# EAGLE design HABduino3.0 (EAGLE 6.4)

## Sheet 1 of 2
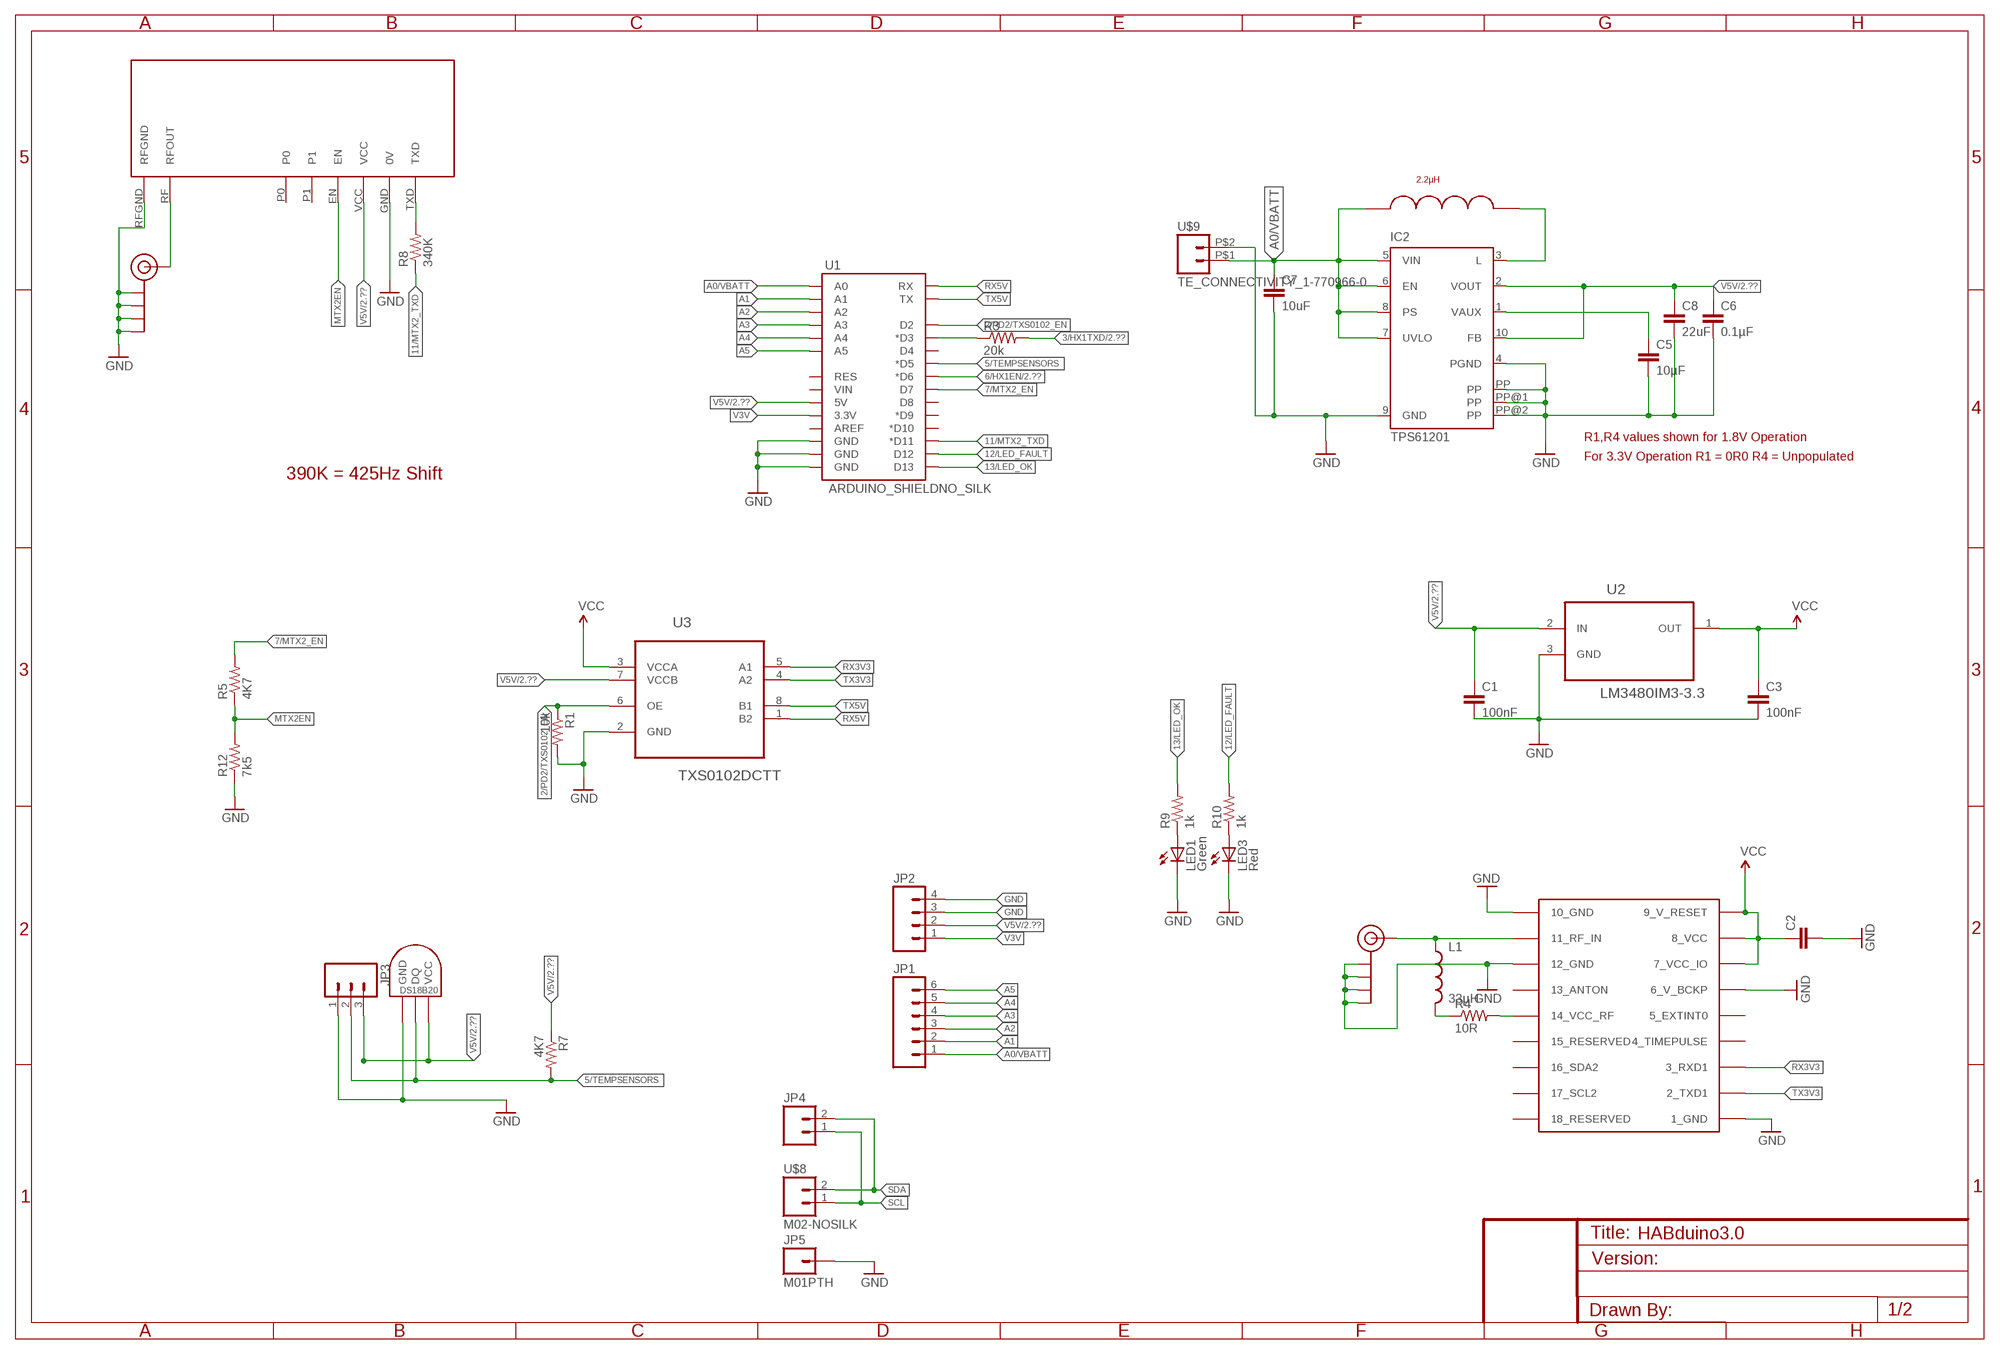
[diagram p0: schematic, sheet 1]

### Parts
C1  100nF  CAP0603-CAP  [0603-CAP]
C2  CAP0603-CAP  [0603-CAP]
C3  100nF  CAP0603-CAP  [0603-CAP]
C5  10µF  CAP0603-CAP  [0603-CAP]
C6  0.1µF  CAP0603-CAP  [0603-CAP]
C7  10uF  CAP1206  [1206]
C8  22uF  CAP1206  [1206]
IC2  TPS61201  [S-PDSO-N10]
J$1  SMA_EDGE  [SMA-EDGE]
J$2  SMA_EDGE  [SMA-EDGE]
JP1  M06SIP  [1X06]
JP2  M04PTH  [1X04]
JP3  M03PTH  [1X03]
JP4  M02PTH  [1X02]
JP5  M01PTH  [1X01]
L1  33µH  INDUCTOR0603  [0603]
LED1  Green  LED0603  [LED-0603]
LED3  Red  LED0603  [LED-0603]
LPS4018  2.2µH  COILCRAFT_LPS4018  [COILCRAFT_LPS4018]
R1  10k  RESISTOR0603-RES  [0603-RES]
R3  20k  RESISTOR0603-RES  [0603-RES]
R4  10R  RESISTOR0603-RES  [0603-RES]
R5  4K7  RESISTOR0603-RES  [0603-RES]
R7  4K7  RESISTOR0603-RES  [0603-RES]
R8  340K  RESISTOR0603-RES  [0603-RES]
R9  1k  RESISTOR0603-RES  [0603-RES]
R10  1k  RESISTOR0603-RES  [0603-RES]
R12  7k5  RESISTOR0603-RES  [0603-RES]
TEMP  DS1821  DS1820SOIC  [DS18B20_SOIC]
U1  ARDUINO_SHIELDNO_SILK  [DUEMILANOVE_VIAS]
U2  LM3480IM3-3.3  [SOT95P251X112-3N]
U3  TXS0102DCTT  [SOP65P400X130-8N]
U$1  UBLOX_MAX  [UBLOX_MAX]
U$4  RADIOMETRIX-MTX2  [RADIOMETRIX-MTX2]
U$8  M02-NOSILK  [M02-NOSILK]
U$9  TE_CONNECTIVITY_1-770966-0  [TE_CONNECTIVITY_1-770966-0]

### Nets
2/PD2/TXS0102_EN: R1.1 U1.D2 U3.6(OE)
3/HX1TXD: R3.2 ; also sheet 2
5/TEMPSENSORS: JP3.2 R7.2 TEMP.DQ U1.D5(*D5)
6/HX1EN: U1.D6(*D6) ; also sheet 2
7/MTX2_EN: R5.2 U1.D7
11/MTX2_TXD: R8.1 U1.D11(*D11)
12/LED_FAULT: R10.2 U1.D12
13/LED_OK: R9.2 U1.D13
A0/VBATT [vcc]: C7.1 IC2.5(VIN) IC2.6(EN) IC2.7(UVLO) IC2.8(PS) JP1.1 LPS4018.P$1 U1.A0 U$9.P$1
A1: JP1.2 U1.A1
A2: JP1.3 U1.A2
A3: JP1.4 U1.A3
A4: JP1.5 U1.A4
A5: JP1.6 U1.A5
GND [vcc]: C1.2 C2.2 C3.2 C5.2 C6.2 C7.2 C8.2 IC2.4(PGND) IC2.9(GND) IC2.PP IC2.PP@1(PP) IC2.PP@2(PP) J$1.GND@0(GND) J$1.GND@1(GND) J$1.GND@2(GND) J$1.GND@3(GND) J$2.GND@0(GND) J$2.GND@1(GND) J$2.GND@2(GND) J$2.GND@3(GND) JP2.3 JP2.4 JP3.1 JP5.1 LED1.C LED3.C R1.2 R12.1 TEMP.GND U1.GND@0(GND) U1.GND@1(GND) U1.GND@2(GND) U2.3(GND) U3.2(GND) U$1.1_GND U$1.6_V_BCKP U$1.10_GND U$1.12_GND U$4.GND(0V) U$4.RFGND U$9.P$2 ; also sheet 2
MTX2EN: R5.1 R12.2 U$4.EN
N$2: R3.1 U1.D3(*D3)
N$3: J$1.SIG(SIGNAL) U$4.RF(RFOUT)
N$4: J$2.SIG(SIGNAL) L1.1 U$1.11_RF_IN
N$5: IC2.3(L) LPS4018.P$2
N$7: R8.2 U$4.TXD
N$11: C5.1 IC2.1(VAUX)
N$12: LED1.A R9.1
N$13: LED3.A R10.1
N$14: L1.2 R4.1
N$15: R4.2 U$1.14_VCC_RF
RX3V3: U3.5(A1) U$1.3_RXD1
RX5V: U1.RX U3.1(B2)
SCL: JP4.1 U$8.1
SDA: JP4.2 U$8.2
TX3V3: U3.4(A2) U$1.2_TXD1
TX5V: U1.TX U3.8(B1)
V3V: JP2.1 U1.3.3V
V5V: C1.1 C6.1 C8.1 IC2.2(VOUT) IC2.10(FB) JP2.2 JP3.3 R7.1 TEMP.VCC U1.5V U2.2(IN) U3.7(VCCB) U$4.VCC ; also sheet 2
VCC: C2.1 C3.1 U2.1(OUT) U3.3(VCCA) U$1.7_VCC_IO U$1.8_VCC U$1.9_V_RESET
Unconnected: U1.AREF U1.D4 U1.D8 U1.D9(*D9) U1.D10(*D10) U1.RES U1.VIN U$1.4_TIMEPULSE U$1.5_EXTINT0 U$1.13_ANTON U$1.15_RESERVED U$1.16_SDA2 U$1.17_SCL2 U$1.18_RESERVED U$4.P0 U$4.P1

### Notes on the sheet
- R1,R4 values shown for 1.8V Operation
- For 3.3V Operation R1 = 0R0 R4 = Unpopulated
- 390K = 425Hz Shift

## Sheet 2 of 2
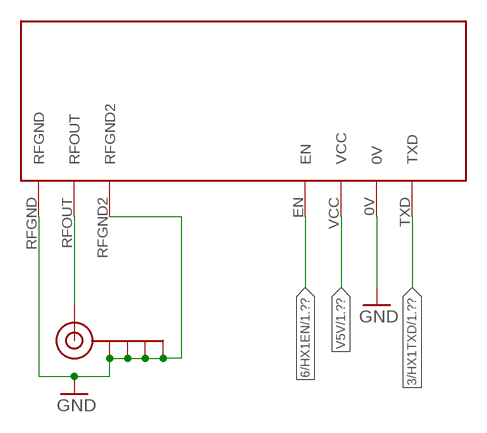
[diagram p1: schematic, sheet 2]

### Parts
J$3  SMA_EDGE  [SMA-EDGE]
U$7  RADIOMETRIX-HX1  [RADIOMETRIX-HX1]

### Nets
3/HX1TXD: U$7.TXD ; also sheet 1
6/HX1EN: U$7.EN ; also sheet 1
GND [vcc]: J$3.GND@0(GND) J$3.GND@1(GND) J$3.GND@2(GND) J$3.GND@3(GND) U$7.0V U$7.RFGND U$7.RFGND2 ; also sheet 1
N$1: J$3.SIG(SIGNAL) U$7.RFOUT
V5V: U$7.VCC ; also sheet 1

## Library data of the parts
C1-C3 C5-C8 = SparkFun:CAP: Capacitor Standard 0603 ceramic capacitor, and 0.1" leaded capacitor.
IC2 = texas:TPS6120*: LOW INPUT VOLTAGE SYNCHRONOUS BOOST CONVERTER WITH 1.3-A SWITCHES Source: http://focus.ti.com/lit/ds/symlink/tps61200.pdf; MPN: TPS61201DRCT; OC_FARNELL: unknown; OC_NEWARK: 37M0068
J$1-J$3 = SparkFun:SMA_EDGE: SMA Antenna Connector End launch SMA connector. The paste layer has been removed so that the connector can be hand soldered onto the board after reflow.
JP1 = SparkFun:M06: Header 6 Standard 6-pin 0.1" header. Use with straight break away headers (SKU : PRT-00116), right angle break away headers (PRT-00553), swiss pins (PRT-00743), machine pins (PRT-00117), and female headers (PRT-00115). Molex polarized connector foot print use with SKU : PRT-08094 with associated crimp pins and housings. NOTES ON THE VARIANTS LOCK and LOCK_LONGPADS... This footprint was designed to help hold the alignment of a through-hole component (i.e. 6-pin header) while soldering it into place. You may notice that each hole has been shifted either up or down by 0.005 of an inch from it's more standard position (which is a perfectly straight line). This slight alteration caused the pins (the squares in the middle) to touch the edges of the holes. Because they are alternating, it causes a "brace" to hold the component in place. 0.005 has proven to be the perfect amount of "off-center" position when using our standard breakaway headers. Although looks a little odd when you look at the bare footprint, once you have a header in there, the alteration is very hard to notice. Also, if you push a header all the way into place, it is covered up entirely on the bottom side. This idea of altering the position of holes to aid alignment will be further integrated into the Sparkfun Library for other footprints. It can help hold any component with 3 or more connection pins.
JP2 = SparkFun:M04: Header 4 Standard 4-pin 0.1" header. Use with straight break away headers (SKU : PRT-00116), right angle break away headers (PRT-00553), swiss pins (PRT-00743), machine pins (PRT-00117), and female headers (PRT-00115). Molex polarized connector foot print use with SKU : PRT-08231 with associated crimp pins and housings. 1MM SMD Version SKU: PRT-10208
JP3 = SparkFun:M03: Header 3 Standard 3-pin 0.1" header. Use with straight break away headers (SKU : PRT-00116), right angle break away headers (PRT-00553), swiss pins (PRT-00743), machine pins (PRT-00117), and female headers (PRT-00115). Molex polarized connector foot print use with SKU : PRT-08232 with associated crimp pins and housings.
JP4 = SparkFun:M02: Header 2 Standard 2-pin 0.1" header. Use with straight break away headers (SKU : PRT-00116), right angle break away headers (PRT-00553), swiss pins (PRT-00743), machine pins (PRT-00117), and female headers (PRT-00115). Molex polarized connector foot print use with SKU : PRT-08233 with associated crimp pins and housings.
JP5 = SparkFun:M01: Header 1 Standard 1-pin 0.1" header. Use with straight break away headers (SKU : PRT-00116), right angle break away headers (PRT-00553), swiss pins (PRT-00743), machine pins (PRT-00117), and female headers (PRT-00115).
L1 = SparkFun:INDUCTOR: Inductors Basic Inductor/Choke - 0603 and 1206. Footprints are not proven and vary greatly between part numbers.
LED1 LED3 = SparkFun:LED: LEDs Standard schematic elements and footprints for 5mm, 3mm, 1206, and 0603 sized LEDs. 5mm - Spark Fun Electronics SKU : COM-00529 (and others)
LPS4018 = StevesCoilCraft:COILCRAFT_LPS4018: CoilCraft LPS4018 series inductor
R1 R3-R5 R7-R10 R12 = SparkFun:RESISTOR: Resistor Basic schematic elements and footprints for 0603, 1206, and PTH resistors.
TEMP = ava:DS1820: DS18B20 Programmable Resolution 1-Wire Digital Thermometer Description The DS18B20 digital thermometer provides 9-bit to 12-bit Celsius temperature measurements and has an alarm function with nonvolatile user-programmable upper and lower trigger points. The DS18B20 communicates over a 1-Wire® bus that by definition requires only one data line (and ground) for communication with a central microprocessor. It has an operating temperature range of -55°C to +125°C and is accurate to ±0.5°C over the range of -10°C to +85°C. In addition, the DS18B20 can derive power directly from the data line ("parasite power"), eliminating the need for an external power supply. Each DS18B20 has a unique 64-bit serial code, which allows multiple DS18B20s to function on the same 1-Wire bus. Thus, it is simple to use one microprocessor to control many DS18B20s distributed over a large area. Applications that can benefit from this feature include HVAC environmental controls, temperature monitoring systems inside buildings, equipment, or machinery, and process monitoring and control systems.
U1 = SparkFun:ARDUINO_SHIELD
U2 = ava:LM3480IM3-3.3: Low-Dropout Linear Voltage; MPN: LM3480IM3-3.3; OC_FARNELL: 1469102; OC_NEWARK: 41K4825; PACKAGE: SOT-3; SUPPLIER: National Semiconductor
U3 = ava:TXS0102DCTT: BIDIRECTIONAL VOLTAGE-LEVEL TRANSLATOR; MPN: TXS0102DCTT; OC_FARNELL: 1567203; OC_NEWARK: 48M1002; PACKAGE: SSOP-8; SUPPLIER: Texas Instruments
U$1 = ava:UBLOX_MAX: UBLOX MAX
U$4 = ava:RADIOMETRIX-MTX2
U$7 = ava:RADIOMETRIX-HX1
U$8 = ava:M02-NOSILK
U$9 = ava:TE_CONNECTIVITY_1-770966-0; FARNELL: 1098556

## Net classes
0 default: width 0.203 mm
1 vcc: width 0.254 mm
2 gnd: width 0.305 mm, drill 0.508 mm, clearance 0.152 mm

## Board
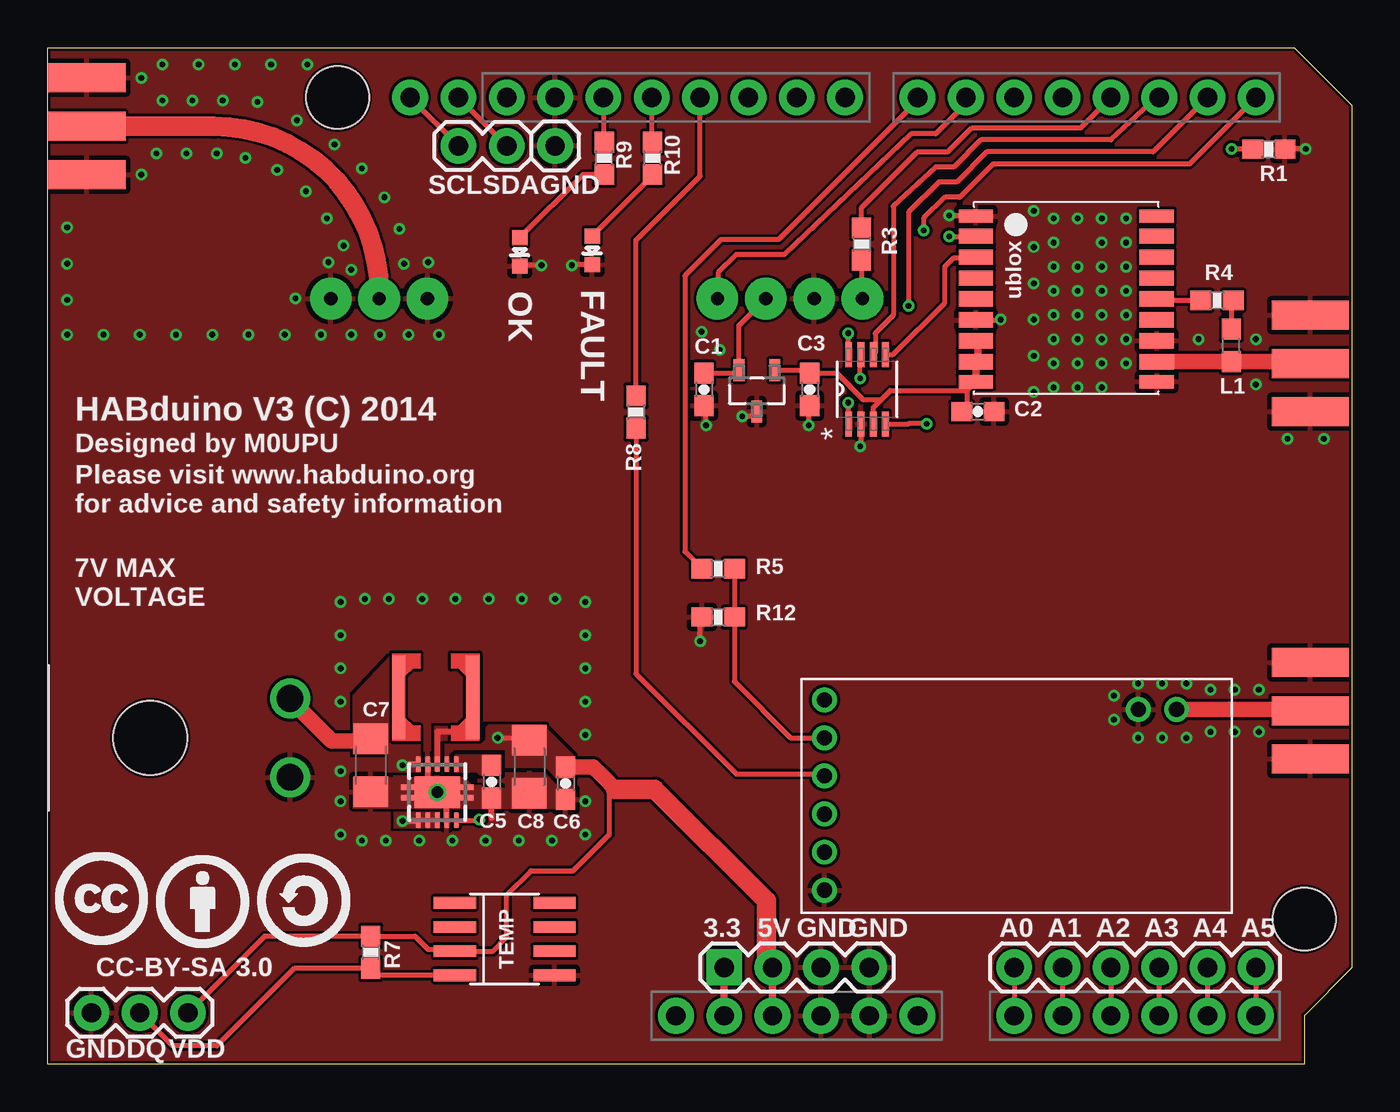
[diagram p2: board, top side]
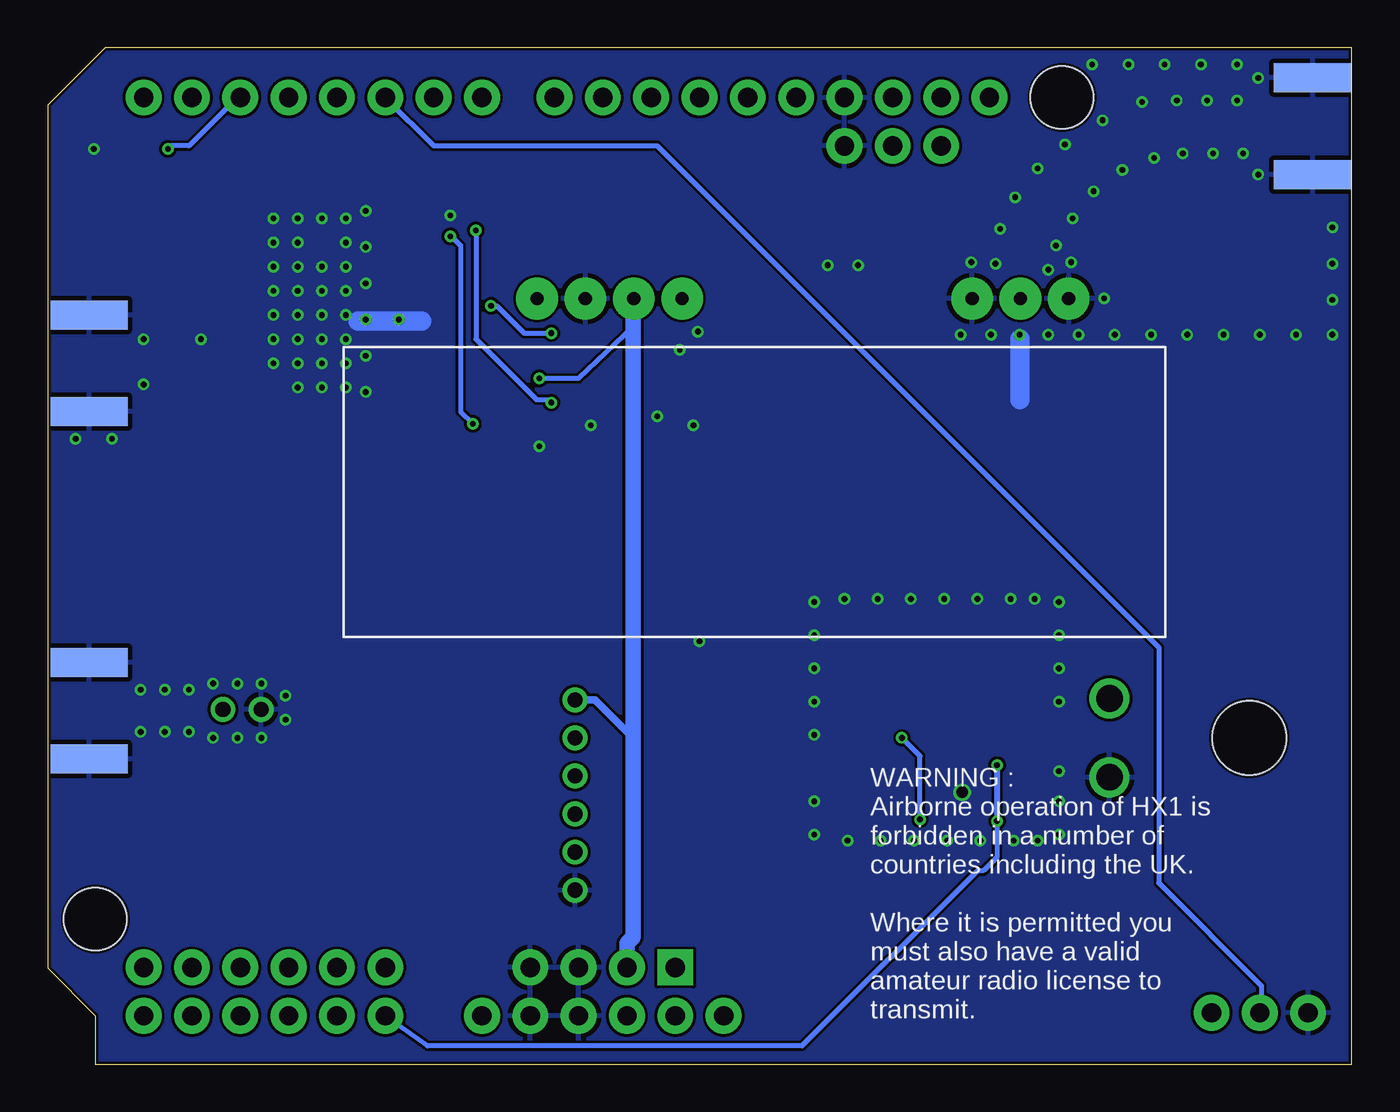
[diagram p3: board, bottom side, seen from below]

Size 68.55 x 53.43 mm. Coordinates in mm from the lower left corner, seen from the top.
Outline: 0,53.43 65.52,53.43 68.55,50.4 68.55,5.05 68.53,5.05 66.04,2.54 66.04,0 0,0 0,53.43
Copper layers (1*16): Top 0.035mm / dielectric 1.5mm / Bottom 0.035mm
Design rules "Hackvana": minimum track width 6mil, minimum drill 0.3mm, track to track 6mil, track to pad 6mil, pad to pad 6mil, via to via 6mil, smd to smd 0mil, copper to edge 6mil, drill to drill 6mil, minimum pad ring 10mil, minimum via ring 6mil, stop-mask expansion 2mil, vias tented up to drill 100mil, thermal gap 10mil
Holes 3.3 mm at 66.04,7.62 15.24,50.8

### Footprints (pad centres in the part's own frame; a part is rotated, then mirrored left to right if it is on the bottom)
0603-CAP = smd 1.1 x 1: 1 -0.85,0; 2 0.85,0
1206 = smd 1.6 x 1.8: 1 -1.4,0; 2 1.4,0
S-PDSO-N10 = smd 0.28 x 0.85: 1 -1,-1.475; 2 -0.5,-1.475; 3 0,-1.475; 4 0.5,-1.475; 5 1,-1.475; 6 1,1.475; 7 0.5,1.475; 8 0,1.475; 9 -0.5,1.475; 10 -1,1.475 | smd 2.4 x 1.65: PP 0,0 | smd 3.8 x 0.28: PP@1 0,0.275; PP@2 0,-0.275
SMA-EDGE = smd 1.524 x 4.064: GND@0 -2.54,0; GND@1 2.54,0; SIG 0,0 | smd 1.524 x 4.064 bottom: GND@2 -2.54,0; GND@3 2.54,0
1X06 = drill 1.016 pad 1.88: 1 0,0; 2 2.54,0; 3 5.08,0; 4 7.62,0; 5 10.16,0; 6 12.7,0
1X04 = drill 1.016 pad 1.88 square: 1 0,0 | drill 1.016 pad 1.88: 2 2.54,0; 3 5.08,0; 4 7.62,0
1X03 = drill 1.016 pad 1.88: 1 0,0; 2 2.54,0; 3 5.08,0
1X02 = drill 1.016 pad 1.88: 1 0,0; 2 2.54,0
1X01 = drill 1.016 pad 1.88: 1 0,0
0603 = smd 1.1 x 1: 1 -0.85,0; 2 0.85,0
LED-0603 = smd 0.8 x 0.8: A 0,-0.75; C 0,0.75
COILCRAFT_LPS4018 = smd 0.7 x 4.4: P$1 -1.95,0; P$2 1.95,0
0603-RES = smd 1.1 x 1: 1 -0.85,0; 2 0.85,0
DS18B20_SOIC = smd 0.61 x 2.21: DQ 1.905,-2.616; GND 1.905,2.616; NC -1.905,-2.616; NC2 -0.635,-2.616; NC3 -1.905,2.616; NC4 -0.635,2.616; NC5 0.635,2.616; VCC 0.635,-2.616
DUEMILANOVE_VIAS = drill 1.016 pad 1.88: 3.3V 50.8,13.97; 5V 50.8,16.51; A0 50.8,29.21; A1 50.8,31.75; A2 50.8,34.29; A3 50.8,36.83; A4 50.8,39.37; A5 50.8,41.91; AREF 2.54,2.54; D2 2.54,36.83; D3 2.54,34.29; D4 2.54,31.75; D5 2.54,29.21; D6 2.54,26.67; D7 2.54,24.13; D8 2.54,20.32; D9 2.54,17.78; D10 2.54,15.24; D11 2.54,12.7; D12 2.54,10.16; D13 2.54,7.62; GND@0 50.8,19.05; GND@1 50.8,21.59; GND@2 2.54,5.08; RES 50.8,11.43; RX 2.54,41.91; TX 2.54,39.37; VIN 50.8,24.13
SOT95P251X112-3N = smd 0.559 x 1.143: 1 -0.94,-1.092; 2 0.94,-1.092; 3 0,1.092
SOP65P400X130-8N = smd 1.321 x 0.356: 1 -1.829,0.965; 2 -1.829,0.33; 3 -1.829,-0.33; 4 -1.829,-0.965; 5 1.829,-0.965; 6 1.829,-0.33; 7 1.829,0.33; 8 1.829,0.965
UBLOX_MAX = smd 1.8 x 0.7: 1_GND 4.95,-4.4; 9_V_RESET 4.95,4.3; 10_GND -4.55,4.3; 18_RESERVED -4.55,-4.4 | smd 1.8 x 0.8: 2_TXD1 4.95,-3.35; 3_RXD1 4.95,-2.25; 4_TIMEPULSE 4.95,-1.15; 5_EXTINT0 4.95,-0.05; 6_V_BCKP 4.95,1.05; 7_VCC_IO 4.95,2.15; 8_VCC 4.95,3.25; 11_RF_IN -4.55,3.25; 12_GND -4.55,2.15; 13_ANTON -4.55,1.05; 14_VCC_RF -4.55,-0.05; 15_RESERVED -4.55,-1.15; 16_SDA2 -4.55,-2.25; 17_SCL2 -4.55,-3.35
RADIOMETRIX-MTX2 = drill 0.8: EN 9.97,-3.25; GND 9.97,4.75; P0 9.97,2.75; P1 9.97,0.75; RF -8.53,-4.75; RFGND -6.53,-4.75; TXD 9.97,-1.25; VCC 9.97,-5.25
RADIOMETRIX-HX1 = drill 0.7 pad 2.184: 0V 8.89,-10.16; EN 3.81,-10.16; RFGND -11.43,-10.16; RFGND2 -16.51,-10.16; RFOUT -13.97,-10.16; TXD 11.43,-10.16; VCC 6.35,-10.16
M02-NOSILK = drill 1.016 pad 1.88: 1 0,0; 2 2.54,0
TE_CONNECTIVITY_1-770966-0 = drill 1.4: P$1 -2.07,7.34; P$2 2.07,7.34 | hole 3.9: 0,0

### Placement (x,y rotation side)
C1  34.5,35.46 270 top
C2  48.9,34.29 0 top
C3  40.05,35.46 270 top
C5  23.34,14.84 270 top
C6  27.23,14.76 270 top
C7  16.99,15.72 270 top
C8  25.32,15.64 270 top
IC2  20.48,14.29 180 top
J$1  66.36,18.57 90 top
J$2  66.36,36.83 90 top
J$3  2.06,49.29 90 top
JP1  50.8,5.08 0 top
JP2  35.56,5.08 0 top
JP3  2.3,2.7 0 top
JP4  21.59,48.26 0 top
JP5  26.67,48.26 0 top
L1  62.2,37.77 90 top
LED1  24.81,42.69 180 top
LED3  28.62,42.77 180 top
LPS4018  20.4,19.29 0 top
R1  64.18,48.09 0 top
R3  42.78,43.1 270 top
R4  61.46,40.14 180 top
R5  35.24,26.04 180 top
R7  16.99,5.87 270 top
R8  30.92,34.27 270 top
R9  29.26,47.61 90 top
R10  31.8,47.61 90 top
R12  35.24,23.5 0 top
TEMP  24.02,6.57 270 top
U1  21.59,53.34 270 top
U2  37.27,35.39 180 top
U3  43.07,35.46 90 top
U$1  53.74,40.16 180 top
U$3  [CC]  0.4,6.27 0 top
U$4  50.8,13.89 180 top
U$5  [CC-BY-21]  5.71,6.11 0 top
U$6  [CC-SA-21]  11.03,6.18 0 top
U$7  31.39,30.07 180 bottom
U$8  19.05,50.8 0 top
U$9  5.4,17.14 270 top

### Tracks (layer width: path | path; a pad name or v marks a point on that pad's centre or on a via)
2/PD2/TXS0102_EN  (via drill 0.3)
  Top 0.254: U1.D2 58.26,50.8 55.88,48.58 49.05,48.58 47.62,47.15 46.67,47.15 44.45,45.09 44.45,39.37 43.5,38.42 43.5,37.39 U3.6 | v62.23,48.1 63.32,48.1 R1.1
  Bottom 0.254: U1.D2 58.58,50.8 61.12,48.26 62.07,48.26 v62.23,48.1
3/HX1TXD
  Top 0.254: R3.2 42.78,40.27 U$7.TXD
5/TEMPSENSORS
  Top 0.254: TEMP.DQ 17.34,4.67 R7.2 12.96,5.02 8.89,0.95 6.59,0.95 JP3.2
  Bottom 0.254: U1.D5 48.26,48.26 36.51,48.26 10.16,21.91 10.16,9.53 4.76,4.13 4.76,2.78 JP3.2
6/HX1EN
  Top 0.254: U$7.EN 35.24,40.27 35.24,41.59 36.2,42.55 38.73,42.55 45.4,48.9 46.67,48.9 48.26,50.48 U1.D6
7/MTX2_EN
  Top 0.254: R5.2 33.5,26.93 33.5,41.43 35.4,43.34 38.42,43.34 45.64,50.56 45.72,50.64 U1.D7
11/MTX2_TXD
  Top 0.254: R8.1 30.92,43.31 34.29,46.67 U1.D11
12/LED_FAULT
  Top 0.254: U1.D12 31.75,48.51 R10.2
13/LED_OK
  Top 0.254: U1.D13 29.21,48.51 R9.2
A0/VBATT  (via drill 0.3)
  Top 0.254: 18.57,12.86 18.62,12.81 IC2.8 18.69,12.81 v18.65,12.78 | JP1.1 U1.A0
  Top 0.305: IC2.5 18.7,15.76 v18.65,15.72 | v18.65,12.78 19.45,12.78 IC2.6
  Top 0.813: C7.1 16.86,16.99 14.92,16.99 12.74,19.17 U$9.P$1
  Bottom 0.254: v18.65,12.78 18.65,10.87 19.37,10.16 19.68,10.16 28.89,0.95 48.58,0.95 U1.A0
  Bottom 0.305: v18.65,15.72 v18.65,12.78
  pour Top (no thermals): 19.61,15.32 17.86,15.32 17.86,16.27 16.03,16.27 16.03,19.37 18.1,21.59 18.81,21.59 18.81,17.62 19.61,17.07
  pour Top (no thermals): 20.64,13.26 20.64,12.38 18.18,12.38 18.18,13.26
A1
  Top 0.254: JP1.2 U1.A1
A2
  Top 0.254: JP1.3 U1.A2
A3
  Top 0.254: U1.A3 JP1.4
A4
  Top 0.254: JP1.5 U1.A4
A5
  Top 0.254: JP1.6 U1.A5
GND  (via drill 0.3, 0.6)
  Top 0.254: v47.39,44.61 48.74,44.61 U$1.1_GND | U3.2 42.74,32.5 v42.7,32.46 | v34.61,33.58 34.61,34.5 C1.2 | v36.51,34.05 37.03,34.05 U2.3 | v40.01,33.58 40.01,34.57 C3.2 | v66.12,48.1 65.05,48.1 R1.2 | U$1.6_V_BCKP 50.07,39.11 v50.09,39.13 | v34.29,22.23 34.29,23.39 R12.1 | LED3.C 27.57,42.02 v27.54,41.99 | v25.96,41.99 24.86,41.99 LED1.C
  Top 0.305: IC2.4 19.98,15.06 IC2.PP@2 | IC2.9 20.98,13.51 IC2.PP@1 | 23.34,12.94 23.34,13.81
  Bottom 1.016: 48.9,39.05 52.23,39.05 | 17.46,34.92 17.46,38.1
  other vias: 63.5,38.1 60.48,38.1 63.5,35.72 56.67,36.83 56.67,38.1 56.67,39.37 56.67,40.64 56.67,41.91 56.67,43.18 56.67,44.45 52.86,36.83 52.86,38.1 52.86,39.37 52.86,40.64 52.86,41.91 52.86,43.18 52.86,44.45 52.86,35.56 54.13,36.83 54.13,38.1 54.13,39.37 54.13,40.64 54.13,41.91 54.13,44.45 54.13,35.56 55.4,36.83 55.4,38.1 55.4,39.37 55.4,40.64 55.4,41.91 55.4,43.18 55.4,44.45 55.4,35.56 15.95,41.75 18.73,42.07 18.49,43.89 17.7,45.56 16.51,47.07 15.08,48.34 13.1,49.61 11.03,50.56 9.21,50.64 7.62,50.64 6.03,50.64 4.92,51.83 15.56,43.02 14.68,44.45 13.57,45.88 12.06,46.99 10.4,47.62 8.89,47.86 7.3,47.86 5.71,47.86 4.92,46.75 17.46,38.34 20.56,38.34 14.37,38.34 20,42.15 14.76,42.15 13.02,40.24 1.03,38.34 65.17,32.86 67.07,32.86 51.83,44.85 51.83,42.94 51.83,41.04 51.83,39.13 51.83,37.23 51.83,35.32 15.95,38.34 18.97,38.34 6.75,38.34 2.94,38.34 4.84,38.34 8.65,38.34 10.56,38.34 12.46,38.34 1.03,43.97 1.03,42.07 1.03,40.16 9.84,52.55 6.03,52.55 7.94,52.55 11.75,52.55 13.65,52.55 20.48,14.29 15.4,22.54 15.4,20.8 15.4,19.05 15.4,13.81 15.4,24.29 15.4,12.06 28.26,22.54 28.26,20.8 28.26,19.05 28.26,17.3 28.26,13.81 28.26,24.29 28.26,12.06 26.51,11.75 24.77,11.75 23.02,11.75 21.27,11.75 19.53,11.75 17.78,11.75 16.51,11.75 26.67,24.45 24.92,24.45 23.18,24.45 21.43,24.45 19.68,24.45 17.94,24.45 16.67,24.45 63.66,19.68 62.39,19.68 61.12,19.68 59.85,20 58.58,20 57.31,20 56.04,19.37 56.04,18.1 57.31,17.14 58.58,17.14 59.85,17.14 61.12,17.46 62.39,17.46 63.66,17.46 34.37,38.5 35.32,37.54 15.4,15.4
  pour Top (no thermals): 27.7,14.68 26.75,14.68 26.11,15.32 24.05,15.32 24.05,14.53 22.46,14.53 21.91,15.08 19.45,15.08 19.37,15 19.37,13.49 19.29,13.41 27.7,13.41
  pour Top (no thermals): 16.03,15.08 19.37,15.08 19.37,13.41 16.03,13.41
  pour Top (rank 2): 0,53.66 65.09,53.66 68.58,50.16 68.58,5.08 66.04,2.54 66.04,0 0,0 0,53.34
  pour Bottom: 0,53.66 65.09,53.66 68.58,50.16 68.58,5.08 66.04,2.54 66.04,0 0,0 0,53.34
MTX2EN
  Top 0.254: R5.1 R12.2 36.09,20.11 39.05,17.14 U$4.EN
N$1
  Top 0.813: J$3.SIG arc90 2.14,49.21
  Top 1.016: U$7.RFOUT 17.42,40.6 arc90 8.73,49.29 2.86,49.29 arc-90 2.7,49.45 2.22,49.45 arc90 J$3.SIG
N$2
  Top 0.254: R3.1 42.78,45.01 45.72,47.94 47.31,47.94 48.58,49.21 54.29,49.21 U1.D3
N$3
  Top 0.813: U$4.RF 66.36,18.64 J$1.SIG
N$4
  Top 0.254: J$2.SIG 66.27,36.83 arc-45 66.04,36.92
  Top 0.813: 66.04,36.92 L1.1 U$1.11_RF_IN
N$5
  Top 0.305: LPS4018.P$2 22.35,17.82 21.99,17.46 20.48,17.46 IC2.3
  pour Top (no thermals): 20.64,15.4 20.32,15.4 20.32,17.78 21.59,17.78 21.59,16.99 20.64,16.99
N$7
  Top 0.254: R8.2 30.92,20.51 36.2,15.24 40.73,15.24 U$4.TXD
N$11
  pour Top (no thermals): 21.35,15.32 22.54,15.32 22.7,15.16 23.81,15.16 23.81,16.27 21.43,16.27 21.35,16.19
N$12
  Top 0.254: R9.1 28.13,46.76 LED1.A
N$13
  Top 0.254: R10.1 31.8,46.69 LED3.A
N$14
  Top 0.254: R4.1 62.2,40.14 L1.2
N$15
  Top 0.254: R4.2 58.29,40.14 U$1.14_VCC_RF
RX3V3
  Top 0.254: U3.5 44.44,37.29 47.15,40.01 47.15,41.91 47.62,42.39 48.76,42.39 U$1.3_RXD1
RX5V  (via drill 0.3)
  Top 0.254: U1.RX 60.01,47.31 49.69,47.31 47.94,45.56 47.15,45.56 46.04,44.45 v46.04,43.81 | v42.07,34.77 42.07,33.67 U3.1
  Bottom 0.254: v46.04,43.81 46.04,38.1 42.86,34.92 42.23,34.92 v42.07,34.77
SCL
  Top 0.254: U$8.1 JP4.1
SDA
  Top 0.254: U$8.2 JP4.2
TX3V3  (via drill 0.3)
  Top 0.254: U3.4 45.23,33.64 45.24,33.66 v46.2,33.66 | v47.39,43.5 48.77,43.5 U$1.2_TXD1
  Bottom 0.254: v47.39,43.5 47.31,43.5 46.83,43.02 46.83,34.29 v46.2,33.66
TX5V  (via drill 0.3)
  Top 0.254: U1.TX 58.1,47.94 49.37,47.94 47.78,46.35 46.83,46.35 45.24,44.77 v45.24,39.85 | v42.07,38.42 42.07,37.33 U3.8
  Bottom 0.254: v45.24,39.85 44.93,39.85 43.5,38.42 v42.07,38.42
V3V
  Top 0.406: JP2.1 U1.3.3V
V5V  (via drill 0.3)
  Top 0.254: v42.7,36.04 42.7,37.26 U3.7 | U$7.VCC 36.34,38.82 U2.2 36.17,36.31 C1.1 | IC2.10 22.59,12.81 v22.7,12.86 | v23.65,17.14 25.21,17.14 C8.1 | 29.13,15.16 29.53,14.76 29.53,12.06 27.62,10.16 25.4,10.16 24.13,8.89 24.13,6.67 23.4,5.94 TEMP.VCC 21.31,6.03 20,6.03 19.31,6.72 R7.1 11.41,6.72 JP3.3
  Top 0.406: JP2.2 U1.5V
  Top 0.813: C6.1 28.68,15.61 29.13,15.16 29.84,14.45
  Top 1.016: 29.84,14.45 31.91,14.45 37.78,8.57 37.78,5.4 JP2.2
  Bottom 0.254: U$7.VCC 37.74,39.69 37.74,38.77 40.64,36.04 v42.7,36.04 | v22.7,12.86 22.7,16.19 v23.65,17.14
  Bottom 0.406: 37.78,39.65 37.74,39.69 | U$4.VCC 39.78,19.14 37.78,17.14
  Bottom 0.813: 37.78,39.65 37.78,17.14 37.78,6.67 38.1,6.35 JP2.2
  pour Top (no thermals): 20.88,15.4 20.88,16.83 22.78,16.83 23.02,17.07 23.02,17.7 23.18,17.86 26.04,17.86 27.7,16.19 27.7,15 26.75,15 26.19,15.56 24.05,15.56 24.05,16.51 21.35,16.51 21.11,16.27 21.11,15.4
VCC
  Top 0.254: 48.9,36.99 48.82,36.91 U$1.8_VCC 48.9,37.02 | U$1.7_VCC_IO 48.82,38.01 48.9,37.94 | U3.3 43.4,34.51 43.81,34.92 | 43.81,34.92 44.29,35.4 48.32,35.4 | 48.32,35.4 U$1.9_V_RESET | 48.32,35.4 48.32,34.57 C2.1 47.94,34.19 | U2.1 39.89,36.48 C3.1 41.47,36.31 42.86,34.92 43.81,34.92
  Top 0.406: U$1.8_VCC U$1.9_V_RESET | 48.9,37.94 48.9,37.02

### Text on the board
tPlace: SCL | SDA | GND | OK | FAULT | HABduino V3 (C) 2014 | Designed by M0UPU | Please visit www.habduino.org / for advice and safety information | 7V MAX / VOLTAGE | 3.3 | 5V | GND | GND | A0 | A1 | A2 | A3 | A4 | A5 | CC-BY-SA 3.0 | GND | DQ | VDD
bPlace: WARNING : / Airborne operation of HX1 is / forbidden in a number of / countries including the UK. / / Where it is permitted you / must also have a valid / amateur radio license to / transmit.
tDocu: (C) HABduino Project 2014 / http://habduino.org / Please visit website for assitance / with legislation and safety advice. / / In most countries you will need to / seek permission to launch a / meteorological balloon. / / http://ukhas.org.uk / http://spacenear.us/tracker | Released under the Creative Commons Attribution Share-Alike 3.0 License | http://creativecommons.org/licenses/by-sa/3.0